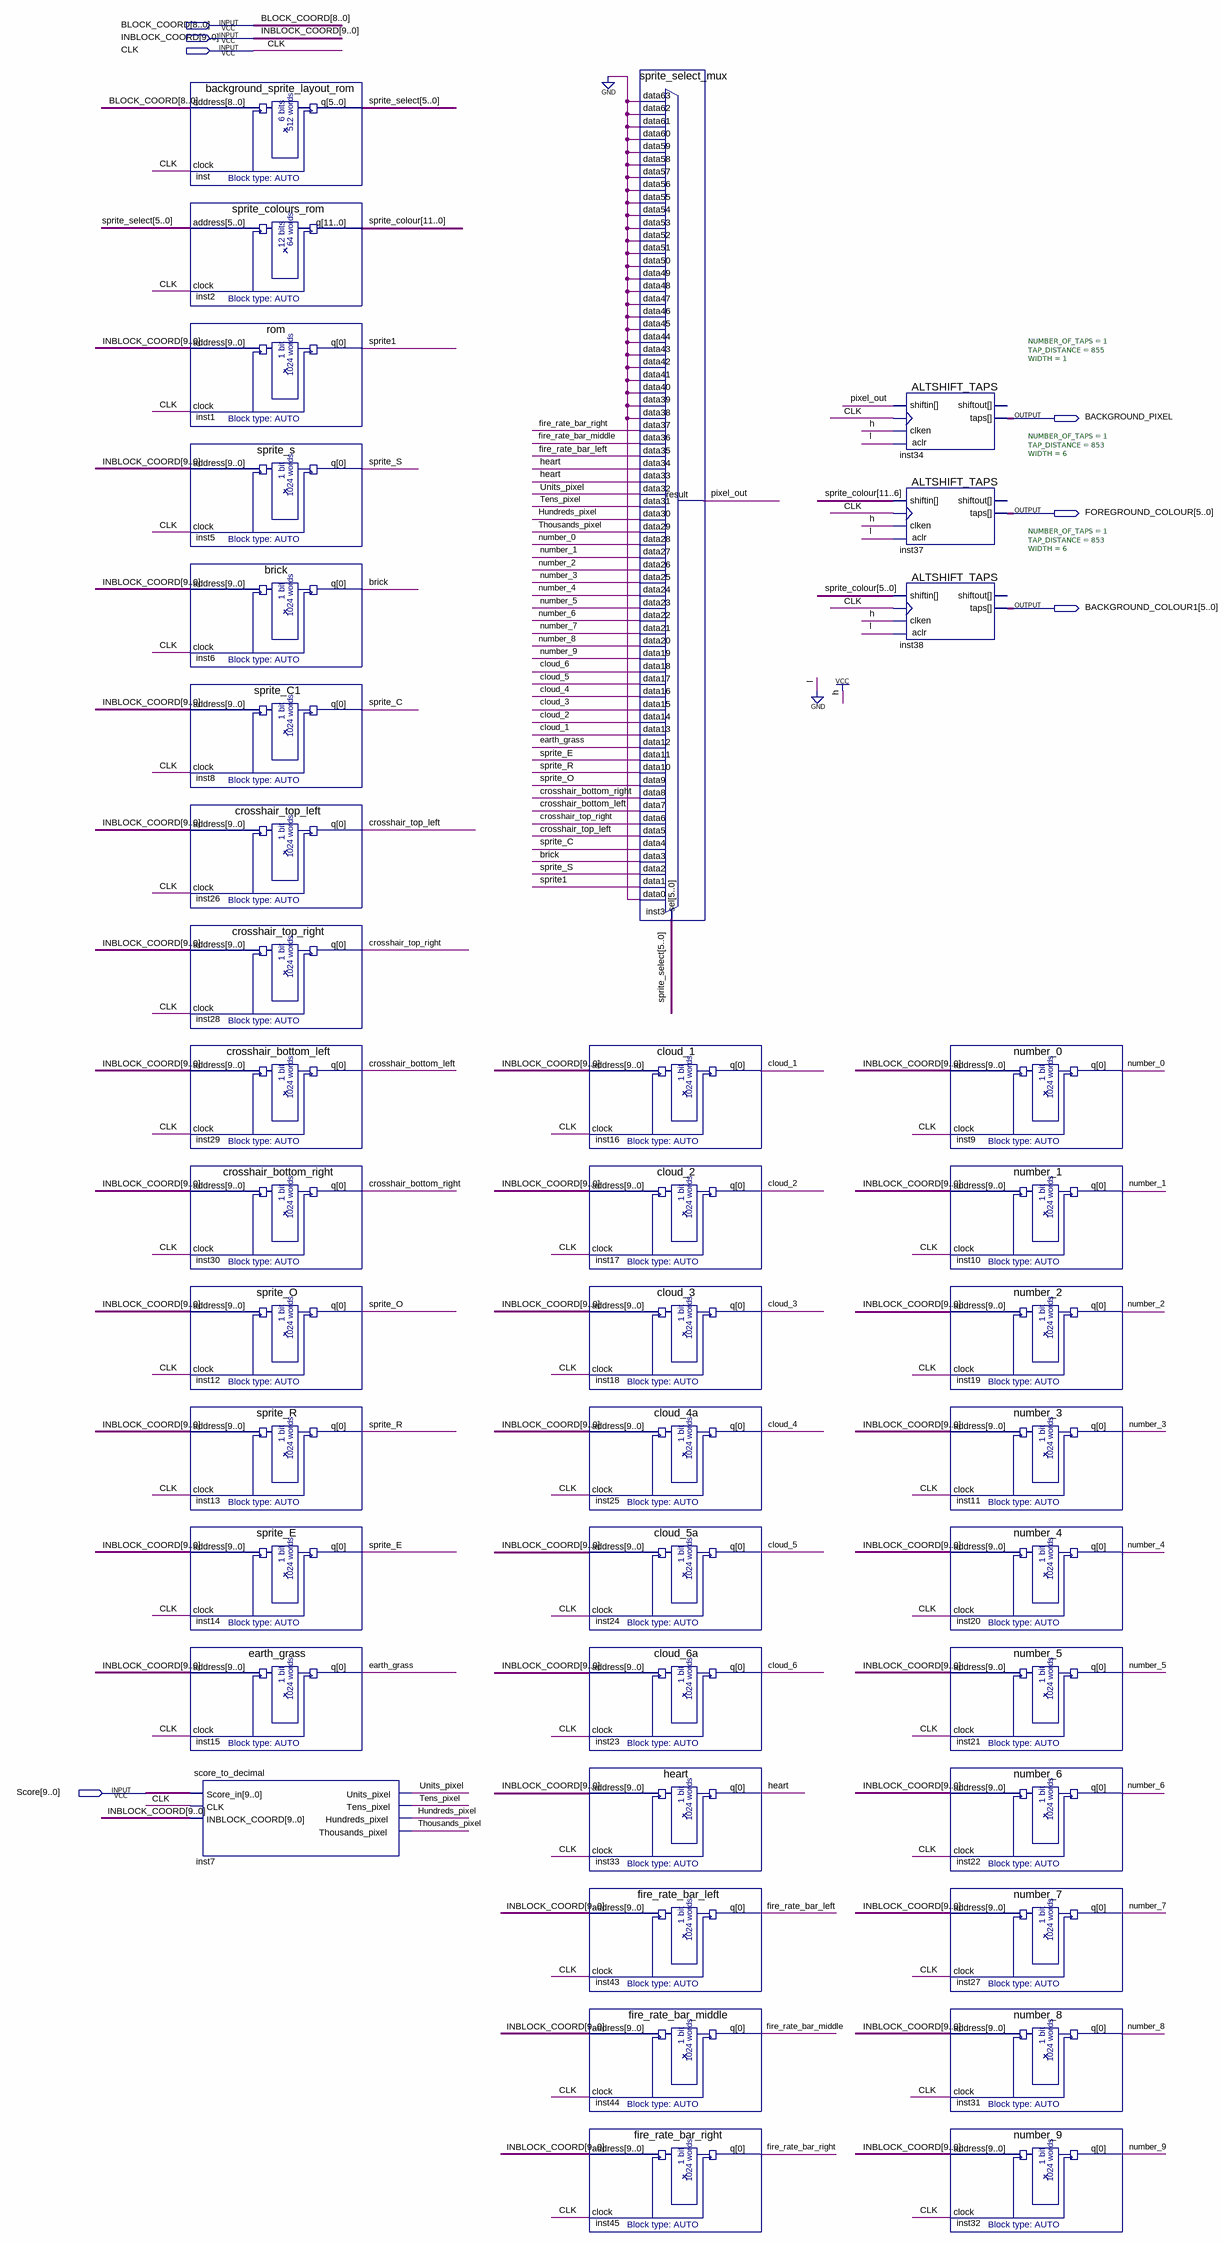
[diagram p0: schematic sheet]
// Quartus schematic background_display.bdf as structural Verilog: 39 symbols, 7 pins
module background_display (
  input  [8:0] BLOCK_COORD,
  input  [9:0] INBLOCK_COORD,
  input  CLK,
  input  [9:0] Score,
  output BACKGROUND_PIXEL,
  output [5:0] FOREGROUND_COLOUR,
  output [5:0] BACKGROUND_COLOUR1
);

  wire brick, cloud_1, cloud_2, cloud_3, cloud_4, cloud_5, cloud_6, crosshair_bottom_left,
       crosshair_bottom_right, crosshair_top_left, crosshair_top_right, earth_grass, fire_rate_bar_left,
       fire_rate_bar_middle, fire_rate_bar_right, heart, Hundreds_pixel, number_0, number_1, number_2,
       number_3, number_4, number_5, number_6, number_7, number_8, number_9, pixel_out, sprite1, sprite_C,
       sprite_E, sprite_O, sprite_R, sprite_S, Tens_pixel, Thousands_pixel, Units_pixel;
  wire [5:0] sprite_select;
  wire [11:0] sprite_colour;

  background_sprite_layout_rom inst (.address(BLOCK_COORD), .clock(CLK), .q(sprite_select));
  sprite_colours_rom inst2 (.address(sprite_select), .clock(CLK), .q(sprite_colour));
  rom inst1 (.address(INBLOCK_COORD), .clock(CLK), .q(sprite1));
  sprite_s inst5 (.address(INBLOCK_COORD), .clock(CLK), .q(sprite_S));
  brick inst6 (.address(INBLOCK_COORD), .clock(CLK), .q(brick));
  sprite_C1 inst8 (.address(INBLOCK_COORD), .clock(CLK), .q(sprite_C));
  crosshair_top_left inst26 (.address(INBLOCK_COORD), .clock(CLK), .q(crosshair_top_left));
  crosshair_top_right inst28 (.address(INBLOCK_COORD), .clock(CLK), .q(crosshair_top_right));
  crosshair_bottom_left inst29 (.address(INBLOCK_COORD), .clock(CLK), .q(crosshair_bottom_left));
  crosshair_bottom_right inst30 (.address(INBLOCK_COORD), .clock(CLK), .q(crosshair_bottom_right));
  sprite_O inst12 (.address(INBLOCK_COORD), .clock(CLK), .q(sprite_O));
  sprite_R inst13 (.address(INBLOCK_COORD), .clock(CLK), .q(sprite_R));
  sprite_E inst14 (.address(INBLOCK_COORD), .clock(CLK), .q(sprite_E));
  earth_grass inst15 (.address(INBLOCK_COORD), .clock(CLK), .q(earth_grass));
  score_to_decimal inst7 (
    .Score_in(Score), .CLK(CLK), .INBLOCK_COORD(INBLOCK_COORD), .Units_pixel(Units_pixel),
    .Tens_pixel(Tens_pixel), .Hundreds_pixel(Hundreds_pixel), .Thousands_pixel(Thousands_pixel));
  cloud_1 inst16 (.address(INBLOCK_COORD), .clock(CLK), .q(cloud_1));
  cloud_2 inst17 (.address(INBLOCK_COORD), .clock(CLK), .q(cloud_2));
  cloud_3 inst18 (.address(INBLOCK_COORD), .clock(CLK), .q(cloud_3));
  cloud_4a inst25 (.address(INBLOCK_COORD), .clock(CLK), .q(cloud_4));
  cloud_5a inst24 (.address(INBLOCK_COORD), .clock(CLK), .q(cloud_5));
  cloud_6a inst23 (.address(INBLOCK_COORD), .clock(CLK), .q(cloud_6));
  heart inst33 (.address(INBLOCK_COORD), .clock(CLK), .q(heart));
  fire_rate_bar_left inst43 (.address(INBLOCK_COORD), .clock(CLK), .q(fire_rate_bar_left));
  fire_rate_bar_middle inst44 (.address(INBLOCK_COORD), .clock(CLK), .q(fire_rate_bar_middle));
  fire_rate_bar_right inst45 (.address(INBLOCK_COORD), .clock(CLK), .q(fire_rate_bar_right));
  sprite_select_mux inst3 (
    .data63(1'b0), .data62(1'b0), .data61(1'b0), .data60(1'b0), .data59(1'b0), .data58(1'b0), .data57(1'b0),
    .data56(1'b0), .data55(1'b0), .data54(1'b0), .data53(1'b0), .data52(1'b0), .data51(1'b0), .data50(1'b0),
    .data49(1'b0), .data48(1'b0), .data47(1'b0), .data46(1'b0), .data45(1'b0), .data44(1'b0), .data43(1'b0),
    .data42(1'b0), .data41(1'b0), .data40(1'b0), .data39(1'b0), .data38(1'b0), .data37(fire_rate_bar_right),
    .data36(fire_rate_bar_middle), .data35(fire_rate_bar_left), .data34(heart), .data33(heart),
    .data32(Units_pixel), .data31(Tens_pixel), .data30(Hundreds_pixel), .data29(Thousands_pixel),
    .data28(number_0), .data27(number_1), .data26(number_2), .data25(number_3), .data24(number_4),
    .data23(number_5), .data22(number_6), .data21(number_7), .data20(number_8), .data19(number_9),
    .data18(cloud_6), .data17(cloud_5), .data16(cloud_4), .data15(cloud_3), .data14(cloud_2),
    .data13(cloud_1), .data12(earth_grass), .data11(sprite_E), .data10(sprite_R), .data9(sprite_O),
    .data8(crosshair_bottom_right), .data7(crosshair_bottom_left), .data6(crosshair_top_right),
    .data5(crosshair_top_left), .data4(sprite_C), .data3(brick), .data2(sprite_S), .data1(sprite1),
    .data0(1'b0), .sel(sprite_select), .result(pixel_out));
  ALTSHIFT_TAPS #(.NUMBER_OF_TAPS(1), .TAP_DISTANCE(855), .WIDTH(1)) inst34 (
    .shiftin(pixel_out), .clken(1'b1), .clock(CLK), .aclr(1'b0), .taps(BACKGROUND_PIXEL));  // open: shiftout
  ALTSHIFT_TAPS #(.NUMBER_OF_TAPS(1), .TAP_DISTANCE(853), .WIDTH(6)) inst37 (
    .shiftin(sprite_colour[11:6]), .clken(1'b1), .clock(CLK), .aclr(1'b0), .taps(FOREGROUND_COLOUR));  // open: shiftout
  ALTSHIFT_TAPS #(.NUMBER_OF_TAPS(1), .TAP_DISTANCE(853), .WIDTH(6)) inst38 (
    .shiftin(sprite_colour[5:0]), .clken(1'b1), .clock(CLK), .aclr(1'b0), .taps(BACKGROUND_COLOUR1));  // open: shiftout
  number_0 inst9 (.address(INBLOCK_COORD), .clock(CLK), .q(number_0));
  number_1 inst10 (.address(INBLOCK_COORD), .clock(CLK), .q(number_1));
  number_2 inst19 (.address(INBLOCK_COORD), .clock(CLK), .q(number_2));
  number_3 inst11 (.address(INBLOCK_COORD), .clock(CLK), .q(number_3));
  number_4 inst20 (.address(INBLOCK_COORD), .clock(CLK), .q(number_4));
  number_5 inst21 (.address(INBLOCK_COORD), .clock(CLK), .q(number_5));
  number_6 inst22 (.address(INBLOCK_COORD), .clock(CLK), .q(number_6));
  number_7 inst27 (.address(INBLOCK_COORD), .clock(CLK), .q(number_7));
  number_8 inst31 (.address(INBLOCK_COORD), .clock(CLK), .q(number_8));
  number_9 inst32 (.address(INBLOCK_COORD), .clock(CLK), .q(number_9));
endmodule
